# Altium schematic sheet Sheet1.SchDoc
size A4
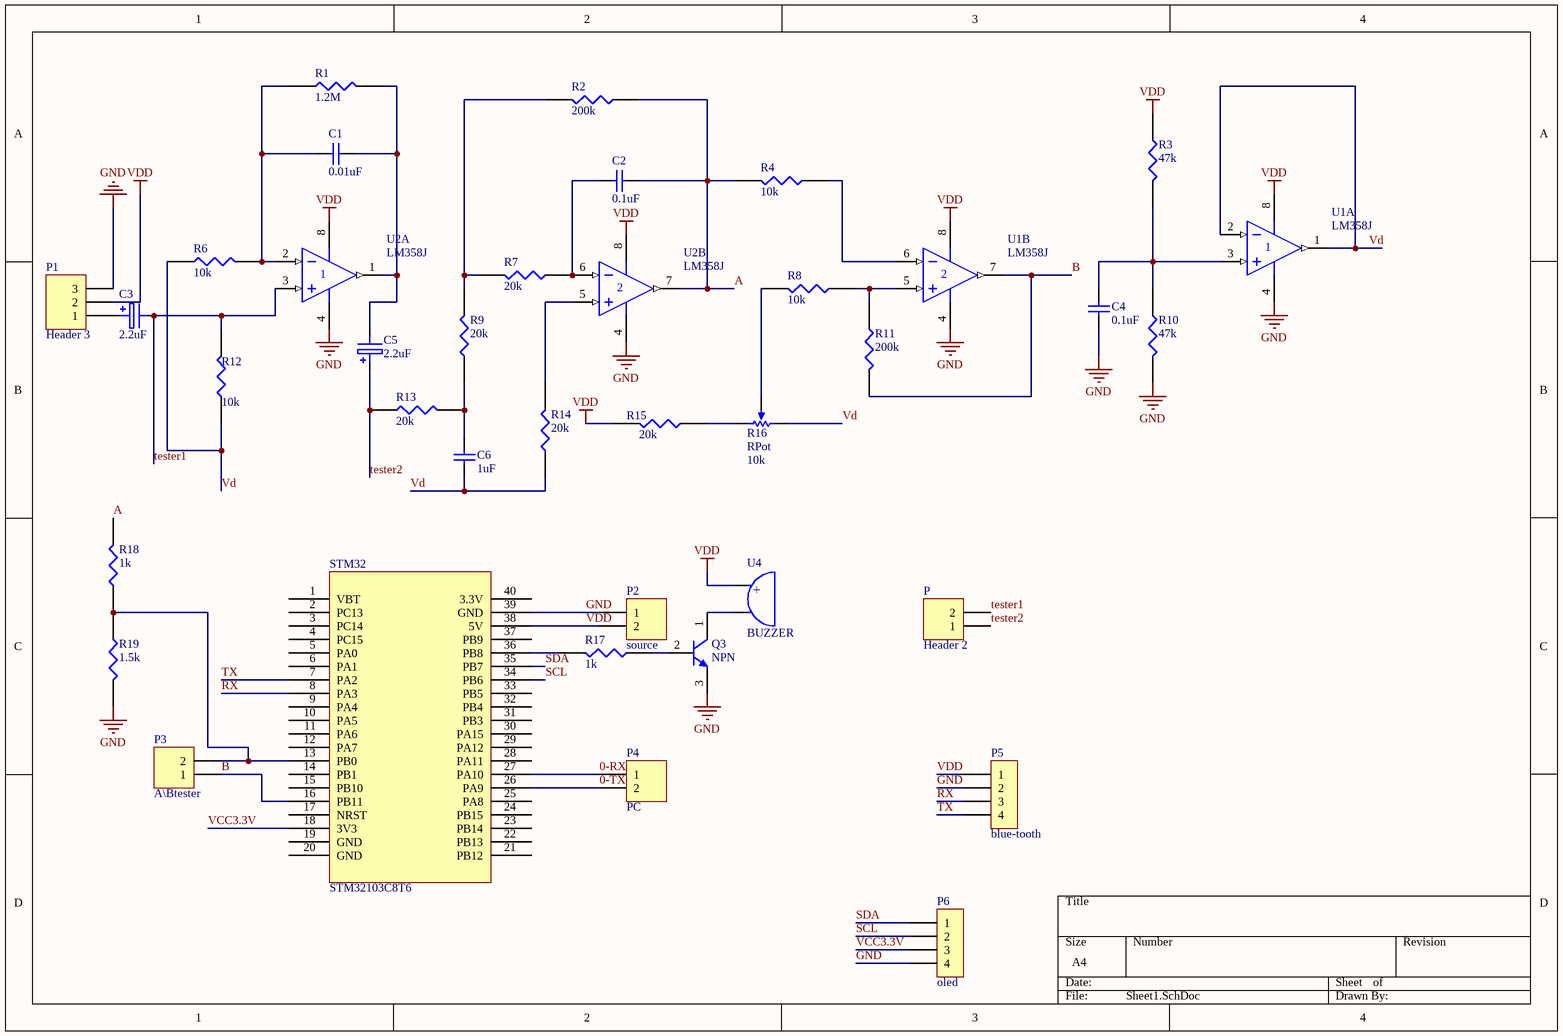
[diagram p0: Sheet1.SchDoc]

## Parts
C1  0.01uF  [C2]
C2  0.1uF  [C2]
C3  2.2uF  [RB.15/.3]
C4  0.1uF  [C2]
C5  2.2uF  [RB.15/.3]
C6  1uF  [C2]
P  Header 2  [SIP2]
P1  Header 3  [SIP3]
P2  source  [SIP2]
P3  A\Btester  [SIP2]
P4  PC  [SIP2]
P5  blue-tooth  [SIP4]
P6  oled  [SSD1306]
Q3  NPN  [TO-P2]
R1  1.2M  [AXIAL0.4]
R2  200k  [AXIAL0.4]
R3  47k  [AXIAL0.4]
R4  10k  [AXIAL0.4]
R6  10k  [AXIAL0.4]
R7  20k  [AXIAL0.4]
R8  10k  [AXIAL0.4]
R9  20k  [AXIAL0.4]
R10  47k  [AXIAL0.4]
R11  200k  [AXIAL0.4]
R12  10k  [AXIAL0.4]
R13  20k  [AXIAL0.4]
R14  20k  [AXIAL0.4]
R15  20k  [AXIAL0.4]
R16  RPot  value 10k  [VR5]
R17  1k  [AXIAL0.4]
R18  1k  [AXIAL0.4]
R19  1.5k  [AXIAL0.4]
STM32  STM32103C8T6  [STM32F103C8T6]
U1  LM358J  [DIP-8]  (parts A,B of 2)
U2  LM358J  [DIP-8]  (parts A,B of 2)
U4  BUZZER  [Buzzer]

## Nets
GND: C4.1 P1.3 P2.1 P5.2 P6.4 Q3.3(E) R10.2 R19.2 STM32.39(GND) U1.4(V-) U2.4(V-)
VDD: P1.2 P2.2 P5.1 R3.1 R15.2 STM32.38(5V) U1.8(V+) U2.8(V+) U4.1(A)
0-RX: P4.1 STM32.27(PA10)
0-TX: P4.2 STM32.26(PA9)
A: C2.2 R2.1 R4.2 R18.2 U2.7(OUT)
B: P3.1 R11.2 STM32.16(PB11) U1.7(OUT)
RX: P5.3 STM32.8(PA3)
SCL: P6.2 STM32.34(PB6)
SDA: P6.1 STM32.35(PB7)
tester1: C3.2 P.2 R12.2 U2.3(IN+)
tester2: C5.2 P.1 R13.1
TX: P5.4 STM32.7(PA2)
VCC3.3V: P6.3 STM32.18(3V3)
Vd: C6.2 R6.1 R12.1 R14.1 R16.1(TOP) U1.1(OUT) U1.2(IN-)
NetC1_1: C1.1 R1.1 R6.2 U2.2(IN-)
NetC1_2: C1.2 C5.1 R1.2 U2.1(OUT)
NetC2_1: C2.1 R7.1 U2.6(IN-)
NetC3_1: C3.1 P1.1
NetC4_2: C4.2 R3.2 R10.1 U1.3(IN+)
NetC6_1: C6.1 R9.1 R13.2
NetP3_2: P3.2 R18.1 R19.1 STM32.13(PB0)
NetQ3_1: Q3.1(C) U4.2(B)
NetQ3_2: Q3.2(B) R17.1
NetR2_2: R2.2 R7.2 R9.2
NetR4_1: R4.1 U1.6(IN-)
NetR8_1: R8.1 R11.1 U1.5(IN+)
NetR8_2: R8.2 R16.3(TAP)
NetR14_2: R14.2 U2.5(IN+)
NetR15_1: R15.1 R16.2(BOT)
NetR17_2: R17.2 STM32.36(PB8)

Not connected (* = marked no-connect by the designer): STM32 1(VBT) 2(PC13) 3(PC14) 4(PC15) 5(PA0) 6(PA1) 9(PA4) 10(PA5) 11(PA6) 12(PA7) 14(PB1) 15(PB10) 17(NRST) 19(GND) 20(GND) 21(PB12) 22(PB13) 23(PB14) 24(PB15) 25(PA8) 28(PA11) 29(PA12) 30(PA15) 31(PB3) 32(PB4) 33(PB5) 37(PB9) 40(3.3V)

## Notes on the sheet
- (in symbol BUZZER) +

## Library data of the parts
C1 C2 C4 C6 = Cap: Capacitor; Value: 10pF; Published: 8-Jun-2000; LatestRevisionDate: 17-Jul-2002; LatestRevisionNote: Re-released for DXP Platform.; PackageReference: RAD-0.3; Publisher: Altium Limited; PackageDescription: Radial Cap, Thru-Hole; 2 Leads; 0.3 in Pin Spacing
C3 C5 = Cap2: 电解电容
P P2-P4 = Header 2: Header, 2-Pin; LatestRevisionDate: 17-Jul-2002; LatestRevisionNote: Re-released for DXP Platform.; Publisher: Altium Limited
P1 = Header 3: Header, 3-Pin; LatestRevisionDate: 17-Jul-2002; LatestRevisionNote: Re-released for DXP Platform.; Publisher: Altium Limited
P5 P6 = Header 4: Connector
Q3 = NPN: NPN Bipolar Transistor; Published: 8-Jun-2000; LatestRevisionDate: 17-Jul-2002; LatestRevisionNote: Re-released for DXP Platform.; PackageReference: TO-226; Publisher: Altium Limited; Code_JEDEC: TO-226-AA
R1-R4 R6-R15 R17-R19 = RES1
R16 = RPot: Potentiometer; Sim Note: Enter the Resistance value and the set point into parameter fields.; Set Position: 0.5; Published: 8-Jun-2000; LatestRevisionDate: 17-Jul-2002; LatestRevisionNote: Re-released for DXP Platform.; PackageReference: VR5; Publisher: Altium Limited; PackageDescription: Variable Resistor, Thru-Hole; 3 Leads
U1 U2 = LM358J: Dual Low-Power Operational Amplifier; Published: 17-Jul-2002; LatestRevisionDate: 06-Jun-2005; LatestRevisionNote: Stylized 3D Model Added.; DatasheetVersion: 1988; PackageReference: 693-02; Publisher: Altium Limited; PackageDescription: DIP; 8 Leads; Row Spacing 7.62 mm; Pitch 2.54 mm; Code_JEDEC: MO-001-AN; ComponentLink1Description: Manufacturer Link; ComponentLink1URL: http://www.onsemi.com/site/products/parametrics/0,4446,251,00.html; ComponentLink2Description: Datasheet; ComponentLink2URL: http://www.onsemi.com/pub/Collateral/LM358-D.PDF